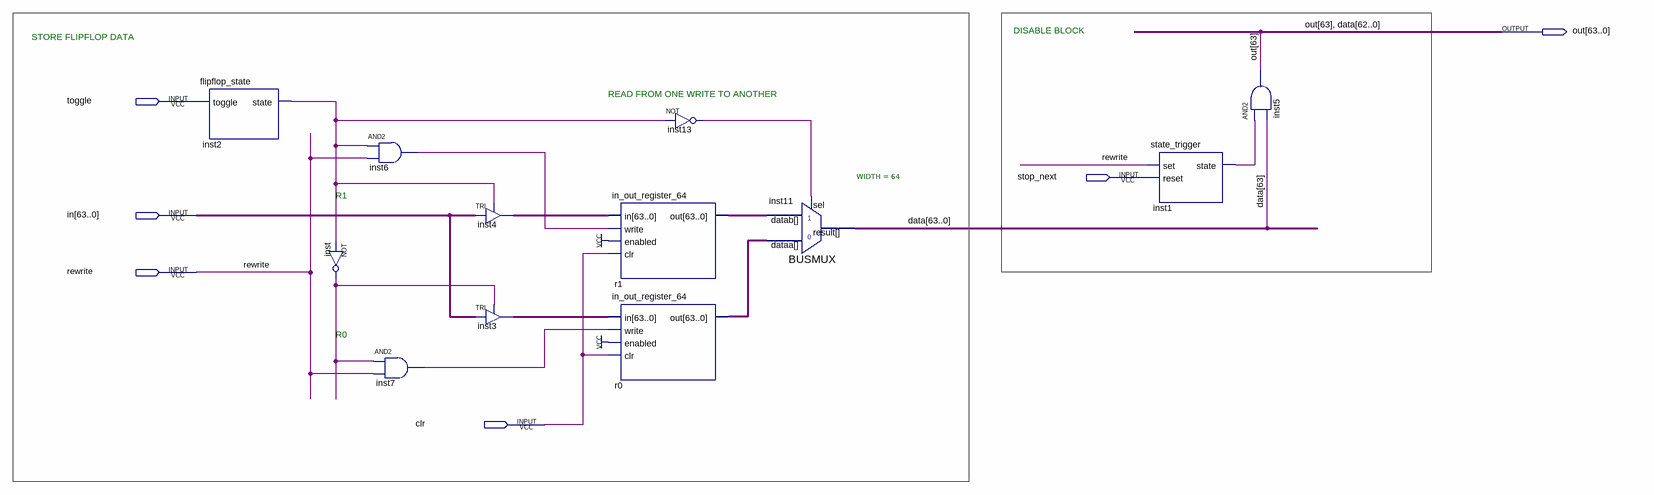
[diagram p0: schematic sheet]
// Quartus schematic flipflop_registers.bdf as structural Verilog: 12 symbols, 6 pins
module flipflop_registers (
  input  toggle,
  input  stop_next,
  input  [63:0] in,
  input  rewrite,
  input  clr,
  output [63:0] out
);

  wire inst1_state, inst2_state, inst6_out, inst7_out, inst13_out, inst_out;
  wire [63:0] inst3_out, inst4_out, r0_out, r1_out;
  wire [63:63] data;

  flipflop_state inst2 (.toggle(toggle), .state(inst2_state));
  not inst (inst_out, inst2_state);
  and inst6 (inst6_out, inst2_state, rewrite);
  and inst7 (inst7_out, inst_out, rewrite);
  TRI inst4[63:0] (.IN(in), .OE(inst2_state), .OUT(inst4_out));
  TRI inst3[63:0] (.IN(in), .OE(inst_out), .OUT(inst3_out));
  in_out_register_64 r1 (.in(inst4_out), .write(inst6_out), .enabled(1'b1), .clr(clr), .out(r1_out));
  in_out_register_64 r0 (.in(inst3_out), .write(inst7_out), .enabled(1'b1), .clr(clr), .out(r0_out));
  not inst13 (inst13_out, inst2_state);
  BUSMUX #(.WIDTH(64)) inst11 (.datab(r1_out), .sel(inst13_out), .dataa(r0_out), .result({data[63], out[62:0]}));
  state_trigger inst1 (.set(rewrite), .reset(stop_next), .state(inst1_state));
  and inst5 (out[63], inst1_state, data[63]);

  // Other names for the same wires on the sheet: data[62:0] = out[62:0]

  // Notes on the sheet:
  //   DISABLE BLOCK
  //   STORE FLIPFLOP DATA
  //   READ FROM ONE WRITE TO ANOTHER
  //   R1
  //   R0
endmodule
